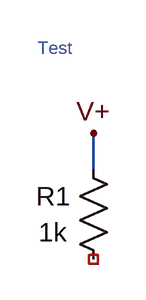
[diagram p0: schematic circuit.asc]
circuit.asc, the LTspice schematic file:
Version 4
SHEET 1 160 272
SYMBOL res 64 128 R0
WINDOW 0 -20 40 Center 2
WINDOW 3 -20 72 Center 2
SYMATTR InstName R1
SYMATTR Value 1k
WIRE 80 112 80 144
FLAG 80 112 V+
TEXT 30 36 Left 1 ;Test

The netlist it stands for:
* circuit.asc
R1 V+ NC_01 1k
* Test
.backanno
.end